# Altium project PCB_Project1.PrjPCB
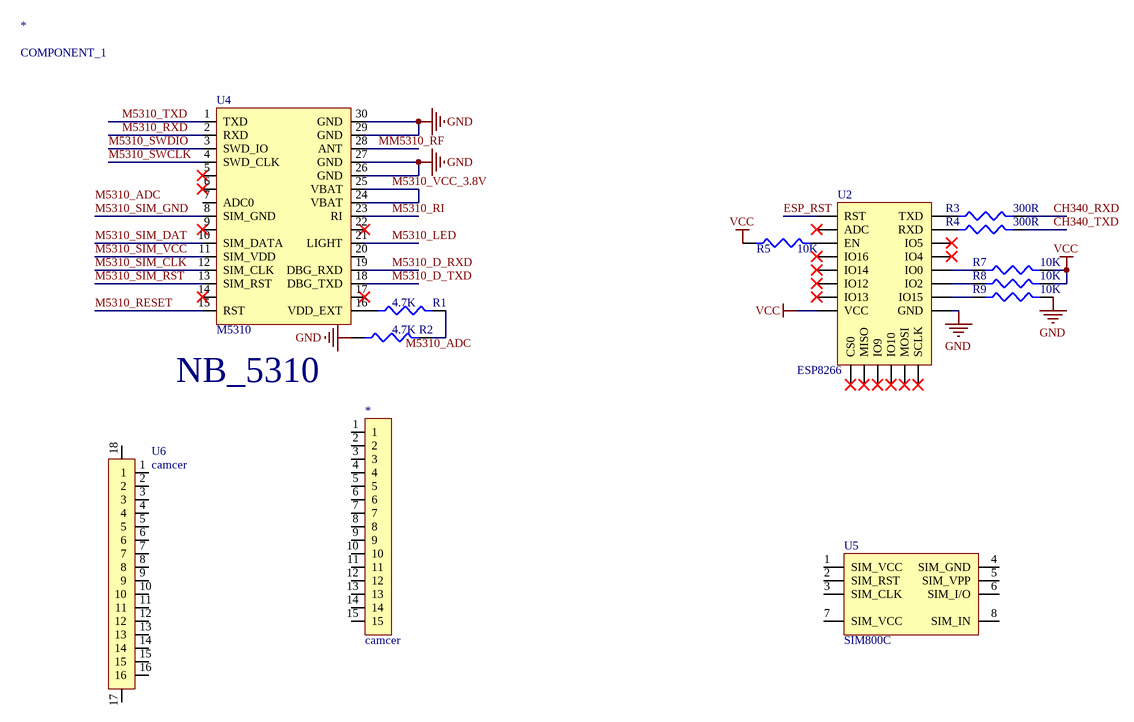
[diagram p0: Sheet1.SchDoc]
2 sheets, 60 parts. Net scope: global (net labels, ports and power ports of the same name join across sheets).
Sheets:
  Sheet1.SchDoc
  Sheet2.SchDoc

## Sheet Sheet1.SchDoc
size A4

### Parts
(Parts that share a designator on the sheet are numbered #1, #2 ... from top to bottom, then left to right.)
*#1  COMPONENT_1
*#2  camcer
R1#1  4.7K
R2#1  4.7K
R3  300R
R4  300R
R5#1  10K
R7#1  10K
R8  10K
R9  10K
U2  ESP8266
U4#1  M5310
U5#1  SIM800C
U6#1  camcer

### Nets
GND: R2#1.1 R9.2 U2.55(GND) U4#1.26(GND) U4#1.27(GND) U4#1.29(GND) U4#1.30(GND)  [project net alarm]
VCC: R5#1.1 R7#1.2 R8.2 U2.41(VCC)
CH340_RXD: R3.2
CH340_TXD: R4.2
ESP_RST: U2.34(RST)
M5310_D_RXD: U4#1.19(DBG_RXD)
M5310_D_TXD: U4#1.18(DBG_TXD)
M5310_LED: U4#1.21(LIGHT)
M5310_RESET: U4#1.15(RST)
M5310_RI: U4#1.23(RI)
M5310_RXD: U4#1.2(RXD)
M5310_SIM_CLK: U4#1.12(SIM_CLK)
M5310_SIM_DAT: U4#1.10(SIM_DATA)
M5310_SIM_GND: U4#1.8(SIM_GND)
M5310_SIM_RST: U4#1.13(SIM_RST)
M5310_SIM_VCC: U4#1.11(SIM_VDD)
M5310_SWCLK: U4#1.4(SWD_CLK)
M5310_SWDIO: U4#1.3(SWD_IO)
M5310_TXD: U4#1.1(TXD)
M5310_VCC_3.8V: U4#1.24(VBAT) U4#1.25(VBAT)
MM5310_RF: U4#1.28(ANT)
NetR1#1_1: R1#1.1 U4#1.16(VDD_EXT)
NetR1#1_2: R1#1.2 R2#1.2
NetR7#1_1: R7#1.1 U2.52(IO0)
NetR8_1: R8.1 U2.53(IO2)
NetR9_1: R9.1 U2.54(IO15)

Not connected (* = marked no-connect by the designer): *#2 1 2 3 4 5 6 7 8 9 10 11 12 13 14 15; R3 1; R4 1; R5#1 2; U2 35(ADC)* 36(EN) 37(IO16)* 38(IO14)* 39(IO12)* 40(IO13)* 42(CS0)* 43(MISO)* 44(IO9)* 45(IO10)* 46(MOSI)* 47(SCLK)* 48(TXD) 49(RXD) 50(IO5)* 51(IO4)*; U4#1 5(41)* 6(42)* 7(ADC0) 9(45)* 14* 17* 20 22*; U5#1 1(SIM_VCC) 2(SIM_RST) 3(SIM_CLK) 4(SIM_GND) 5(SIM_VPP) 6(SIM_I/O) 7(SIM_VCC) 8(SIM_IN); U6#1 1 2 3 4 5 6 7 8 9 10 11 12 13 14 15 16 17(19) 18

### Notes on the sheet
- NB_5310
- Labels drawn without touching a wire or pin: M5310_ADC

### Library data of the parts
R1#1 R2#1 R3 R4 R5#1 R7#1 R8 R9 = 电位器2
U4#1 = NB
U5#1 = SIM

## Sheet Sheet2.SchDoc
size A4
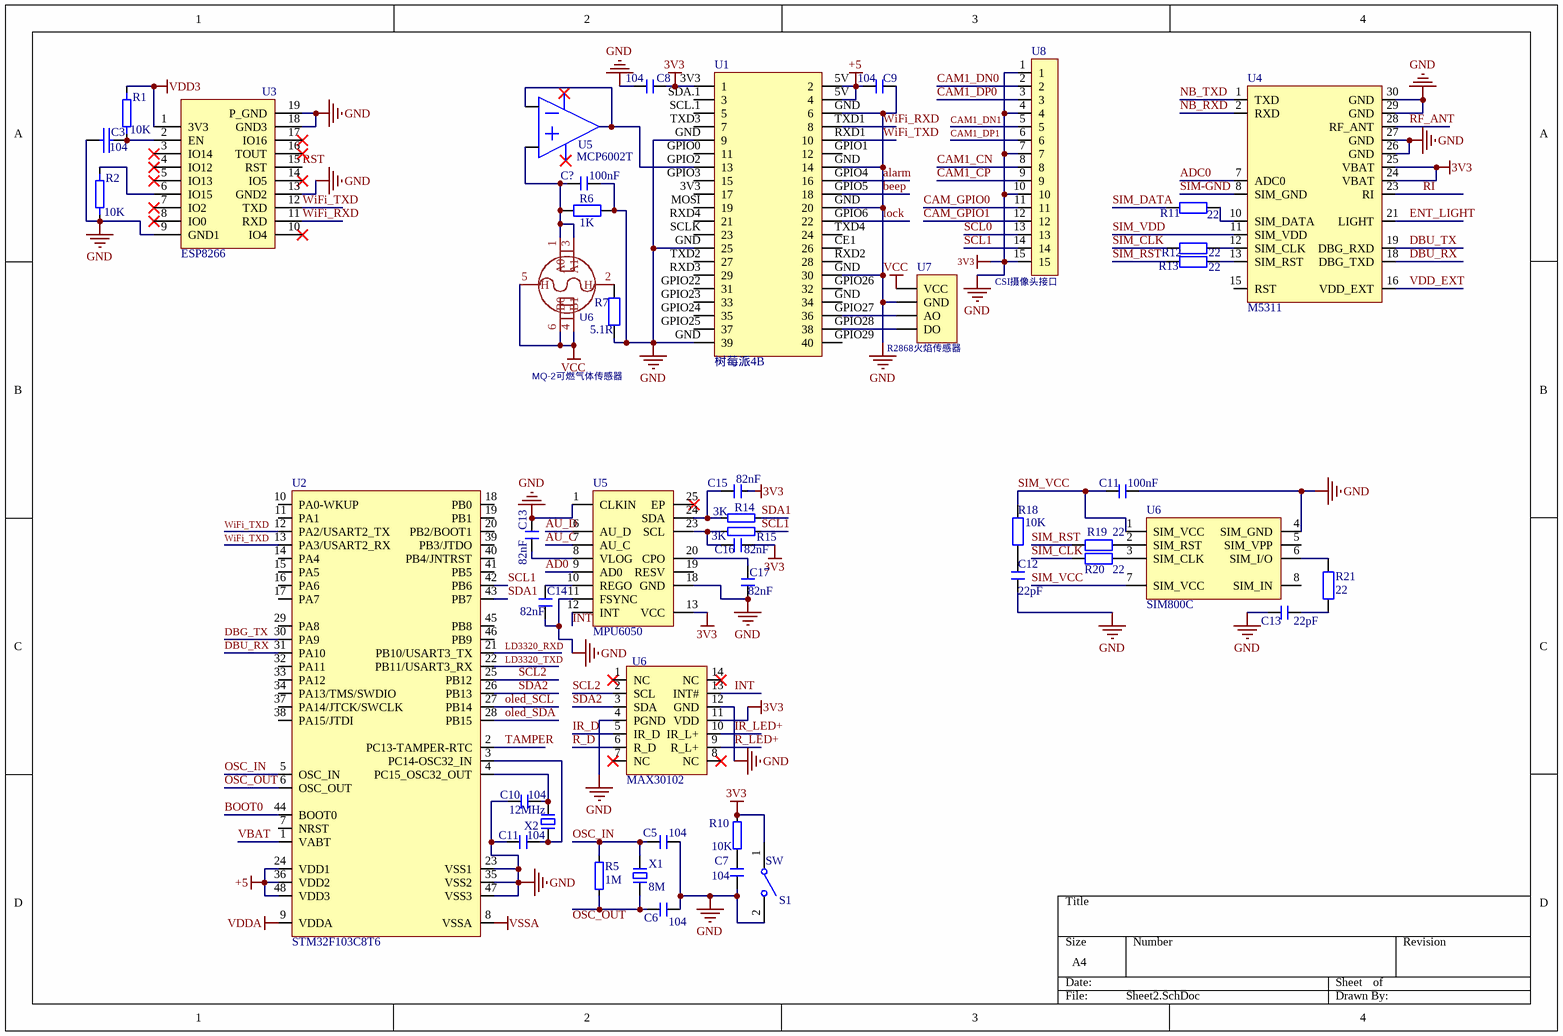
[diagram p1: Sheet2.SchDoc]

### Parts
(Parts that share a designator on the sheet are numbered #1, #2 ... from top to bottom, then left to right.)
C3  104  [RAD0.1]
C5  104  [0603C]
C6  104  [0603C]
C7  104  [0603C]
C8  104  [0603C]
C9  104  [0603C]
C10  104  [0603C]
C11#1  100nF  [C 0805_L]
C11#2  104  [0603C]
C12  22pF  [C 0805_L]
C13#1  82nF  [0603C]
C13#2  22pF  [0603C]
C14  82nF  [0603C]
C15  82nF  [0603C]
C16  82nF  [0603C]
C17  82nF  [0603C]
C?  100nF  [C 0805_L]
R1#2  10K  [VR]
R2#2  10K  [VR]
R5#2  1M  [R 0603_M]
R6  1K  [R 0805_L]
R7#2  5.1R  [R 0805_L]
R10  10K  [R 0603_M]
R11  22  [R 0805_L]
R12  22  [R 0805_L]
R13  22  [R 0805_L]
R14  3K  [R 0603_M]
R15  3K  [R 0603_M]
R18  10K  [R 0805_L]
R19  22  [R 0805_L]
R20  22  [R 0805_L]
R21  22  [R 0805_L]
S1  SW  [TSW SMD-3*6*5]
U1  树莓派4B
U3  ESP8266
U4#2  M5311
U5#2  MCP6002T  [R 0603_M]
U5#3  MPU6050
U6#2  MQ-2可燃气体传感器  [SENSOR-TH_MQ-2]
U6#3  SIM800C
U6#4  MAX30102
U7  R2868火焰传感器
U8  CSI摄像头接口
U?  STM32F103C8T6  [LQFP-48_M]
X1  8M  [OSC UM-5 - duplicate]
X2  12MHz  [OSC UM-5 - duplicate]

### Nets
+5: C9.1 U1.5V(2) U?.24(VDD1) U?.36(VDD2) U?.48(VDD3)
alarm: C3.1 C5.2 C6.2 C7.1 C8.1 C8.2 C9.2 C10.1 C11#1.1 C11#2.1 C12.2 C13#1.2 C13#2.2 C14.1 C15.2 C16.2 C17.1 C?.1 R2#2.1 R6.1 R7#2.2 R10.2 S1.1 S1.2 U1.3V3(1) U1.GND(6) U1.GPIO4(16) U1.GPIO5(18) U1.GPIO6(22) U1.RXD1(10) U1.TXD1(8) U3.9(GND1) U3.11(RXD) U3.12(TXD) U3.13(GND2) U3.18(GND3) U3.19(P_GND) U4#2.24(VBAT) U4#2.25(VBAT) U4#2.26(GND) U4#2.27(GND) U4#2.29(GND) U4#2.30(GND) U5#3.1(CLKIN) U5#3.11(FSYNC) U5#3.13(VCC) U5#3.18(GND) U6#3.4(SIM_GND) U6#4.4(PGND) U6#4.9(R_L+) U6#4.10(IR_L+) U6#4.11(VDD) U6#4.12(GND) U7.45(GND) U8.1 U8.4 U8.7 U8.10 U8.15 U?.12(PA2/USART2_TX) U?.13(PA3/USART2_RX) U?.23(VSS1) U?.35(VSS2) U?.47(VSS3)  [also labelled 3V3, beep, GND, IR_LED+, lock, R_LED+, WiFi_RXD, WiFi_TXD]
VCC: U6#2.4(B1) U6#2.5(H) U6#2.6(B0) U7.45(VCC)
VDD3: R1#2.2 U3.1(3V3)
VDDA: U?.9(VDDA)
VSSA: U?.8(VSSA)
AD0: U5#3.9(AD0)
ADC0: U4#2.7(ADC0)
AU_C: U5#3.7(AU_C)
AU_D: U5#3.6(AU_D)
BOOT0: U?.44(BOOT0)
CAM1_CN: U8.8
CAM1_CP: U8.9
CAM1_DN0: U8.2
CAM1_DN1: U8.5
CAM1_DP0: U8.3
CAM1_DP1: U8.6
CAM_GPIO0: U8.11
CAM_GPIO1: U8.12
DBG_TX: U?.30(PA9)
DBU_RX: U4#2.18(DBG_TXD) U?.31(PA10)
DBU_TX: U4#2.19(DBG_RXD)
ENT_LIGHT: U4#2.21(LIGHT)
INT: U5#3.12(INT) U6#4.13(INT#)
IR_D: U6#4.5(IR_D)
LD3320_RXD: U?.21(PB10/USART3_TX)
LD3320_TXD: U?.22(PB11/USART3_RX)
NB_RXD: U4#2.2(RXD)
NB_TXD: U4#2.1(TXD)
oled_SCL: U?.27(PB14)
oled_SDA: U?.28(PB15)
OSC_IN: C5.1 R5#2.2 U?.5(OSC_IN) X1.2
OSC_OUT: U?.6(OSC_OUT)
R_D: U6#4.6(R_D)
RF_ANT: U4#2.28(RF_ANT)
RI: U4#2.23(RI)
RST: U3.15(RST)
SCL0: U8.13
SCL1: R15.1 U8.14 U?.42(PB6)
SCL2: U6#4.2(SCL) U?.25(PB12)
SDA1: R14.1 U?.43(PB7)
SDA2: U6#4.3(SDA) U?.26(PB13)
SIM-GND: U4#2.8(SIM_GND)
SIM_CLK: R12.2 R20.1
SIM_DATA: R11.2
SIM_RST: R13.2 R19.1
SIM_VCC: C11#1.2 R18.1 U6#3.1(SIM_VCC) U6#3.7(SIM_VCC)
SIM_VDD: U4#2.11(SIM_VDD)
TAMPER: U?.2(PC13-TAMPER-RTC)
VBAT: U?.1(VABT)
VDD_EXT: U4#2.16(VDD_EXT)
NetC3_2: C3.2 R1#2.1 U3.2(EN)
NetC6_1: C6.1 R5#2.1 X1.1
NetC7_2: C7.2 R10.1
NetC10_2: C10.2 U?.4(PC15_OSC32_OUT) X2.1
NetC11#2_2: C11#2.2 U?.3(PC14-OSC32_IN) X2.2
NetC12_1: C12.1 R18.2
NetC13#1_1: C13#1.1 U5#3.8(VLOG)
NetC13#2_1: C13#2.1 R21.1
NetC14_2: C14.2 U5#3.10(REGO)
NetC15_1: C15.1 R14.2 U5#3.24(SDA)
NetC16_1: C16.1 R15.2 U5#3.23(SCL)
NetC17_2: C17.2 U5#3.20(CPO)
NetC?_2: C?.2 R6.2 U6#2.1(A0) U6#2.3(A1)
NetR2#2_2: R2#2.2 U3.6(IO15)
NetR7#2_1: R7#2.1 U6#2.2(H)
NetR11_1: R11.1 U4#2.10(SIM_DATA)
NetR12_1: R12.1 U4#2.12(SIM_CLK)
NetR13_1: R13.1 U4#2.13(SIM_RST)
NetR19_2: R19.2 U6#3.2(SIM_RST)
NetR20_2: R20.2 U6#3.3(SIM_CLK)
NetR21_2: R21.2 U6#3.6(SIM_I/O)
NetU1_GPIO27: U1.GPIO27(36) U7.45(AO)
NetU1_GPIO28: U1.GPIO28(38) U7.44(DO)

Not connected (* = marked no-connect by the designer): U1 CE1(26) GPIO0(11) GPIO1(12) GPIO2(13) GPIO3(15) GPIO22(31) GPIO23(33) GPIO24(35) GPIO25(37) GPIO26(32) GPIO29(40) MOSI(19) RXD2(28) RXD3(29) RXD4(21) SCL.1(5) SCLK(23) SDA.1(3) TXD2(27) TXD3(7) TXD4(24); U3 3(IO14)* 4(IO12)* 5(IO13)* 7(IO2)* 8(IO0)* 10(IO4)* 14(IO5)* 16(TOUT)* 17(IO16)*; U4#2 15(RST); U5#3 19(RESV) 25(EP)*; U6#3 5(SIM_VPP) 8(SIM_IN); U6#4 1(NC)* 7(NC)* 8(NC)* 14(NC)*; U? 7(NRST) 10(PA0-WKUP) 11(PA1) 14(PA4) 15(PA5) 16(PA6) 17(PA7) 18(PB0) 19(PB1) 20(PB2/BOOT1) 29(PA8) 32(PA11) 33(PA12) 34(PA13/TMS/SWDIO) 37(PA14/JTCK/SWCLK) 38(PA15/JTDI) 39(PB3/JTDO) 40(PB4/JNTRST) 41(PB5) 45(PB8) 46(PB9)

### Notes on the sheet
- (near U?) U2
- Labels drawn without touching a wire or pin: OSC_OUT

### Library data of the parts
C3 = 普通电容: Capacitor
C5-C10 C11#1 C11#2 C12 C13#1 C13#2 C14-C17 C? = C: 无极性贴片电容; 版权归属: 源创客; BOM名称: 无极性贴片电容; 学习资源: www.ooocke.com
R1#2 R2#2 = 电位器: Potentiometer
R5#2 R10 R14 R15 U5#2 = 普通电阻
R6 R7#2 R11-R13 R18-R21 = R: 贴片电阻; 版权归属: 源创客; BOM名称: 贴片电阻; 学习资源: www.ooocke.com
S1 = KCD1-101: 1路单刀船型开关; 版权归属: 源创客; BOM名称: 1路单刀船型开关; 学习资源: www.ooocke.com
U1 = pi
U3 = ESP8266_1
U4#2 = NB_2
U6#2 = MQ-2: BOM_Manufacturer: Winsen; BOM_Paste Type: expand; BOM_Supplier: LCSC; BOM_Manufacturer Part: MQ-2; BOM_Supplier Part: C99296; spicePre: U; spiceSymbolName: MQ-2
U6#3 = SIM
U7 = 3kou
U8 = camcer
U? = STM32F103C8T6: IC
X1 X2 = XTAL-2P: 2脚无源脚晶振; 版权归属: 源创客; BOM名称: 2脚无源脚晶振; 学习资源: www.ooocke.com

## Nets that join several sheets
alarm: Sheet1 (7 pins), Sheet2 (64 pins)
VCC: Sheet1 (R5#1.1 R7#1.2 R8.2 U2.41), Sheet2 (U6#2.4 U6#2.5 U6#2.6 U7.45)